# Altium schematic sheet TCP_485_Master.SchDoc
size A4
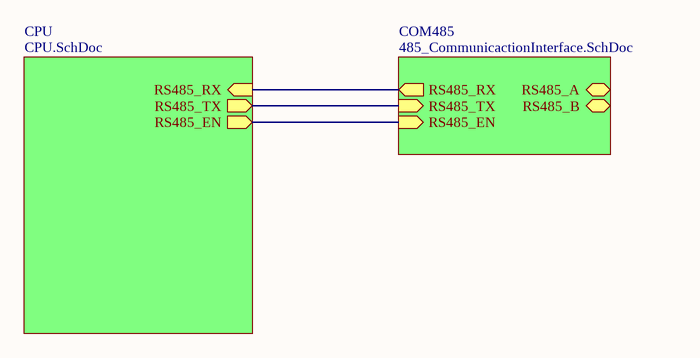
[diagram p0: TCP_485_Master.SchDoc]

## Sub-sheets
COM485 = 485_CommunicactionInterface.SchDoc: RS485_RX (out), RS485_TX (in), RS485_EN (in), RS485_A (bidir), RS485_B (bidir)
CPU = CPU.SchDoc: RS485_RX (in), RS485_TX (out), RS485_EN (out)

## Nets
(unnamed): sheet CPU/RS485_RX, sheet COM485/RS485_RX
(unnamed): sheet CPU/RS485_TX, sheet COM485/RS485_TX
(unnamed): sheet CPU/RS485_EN, sheet COM485/RS485_EN